# Altium project pipe_corner_noled.PrjPCB
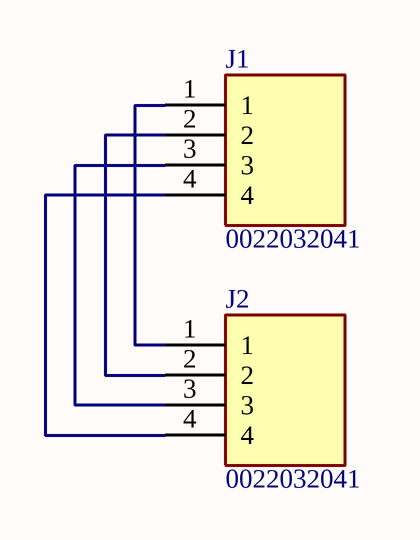
[diagram p0: pipe_corner_noled_schematic.SchDoc]
1 sheet, 2 parts. Net scope: global (net labels, ports and power ports of the same name join across sheets).
Board file: pipe_corner_noled_pcb.PcbDoc

## Sheet pipe_corner_noled_schematic.SchDoc
size A4

### Parts
J1  0022032041  [HDRV4W87P0X254_1X4_991X236X1155P]
J2  0022032041  [HDRV4W87P0X254_1X4_991X236X1155P]

### Nets
NetJ1_1: J1.1 J2.1
NetJ1_2: J1.2 J2.2
NetJ1_3: J1.3 J2.3
NetJ1_4: J1.4 J2.4

### Library data of the parts
J1 J2 = 0022032041: Connector; Manufacturer_Name: Molex; Datasheet Link: http://www.molex.com/pdm_docs/sd/022032041_sd.pdf; Height: 11.55mm; Manufacturer_Part_Number: 0022032041; Mouser Part Number: N/A; Mouser Price/Stock: https://www.mouser.com/Search/Refine.aspx?Keyword=N%2FA